# EAGLE design Sensor_Board_0x06_CO2_CCS811_v2 (EAGLE 8.5.2)
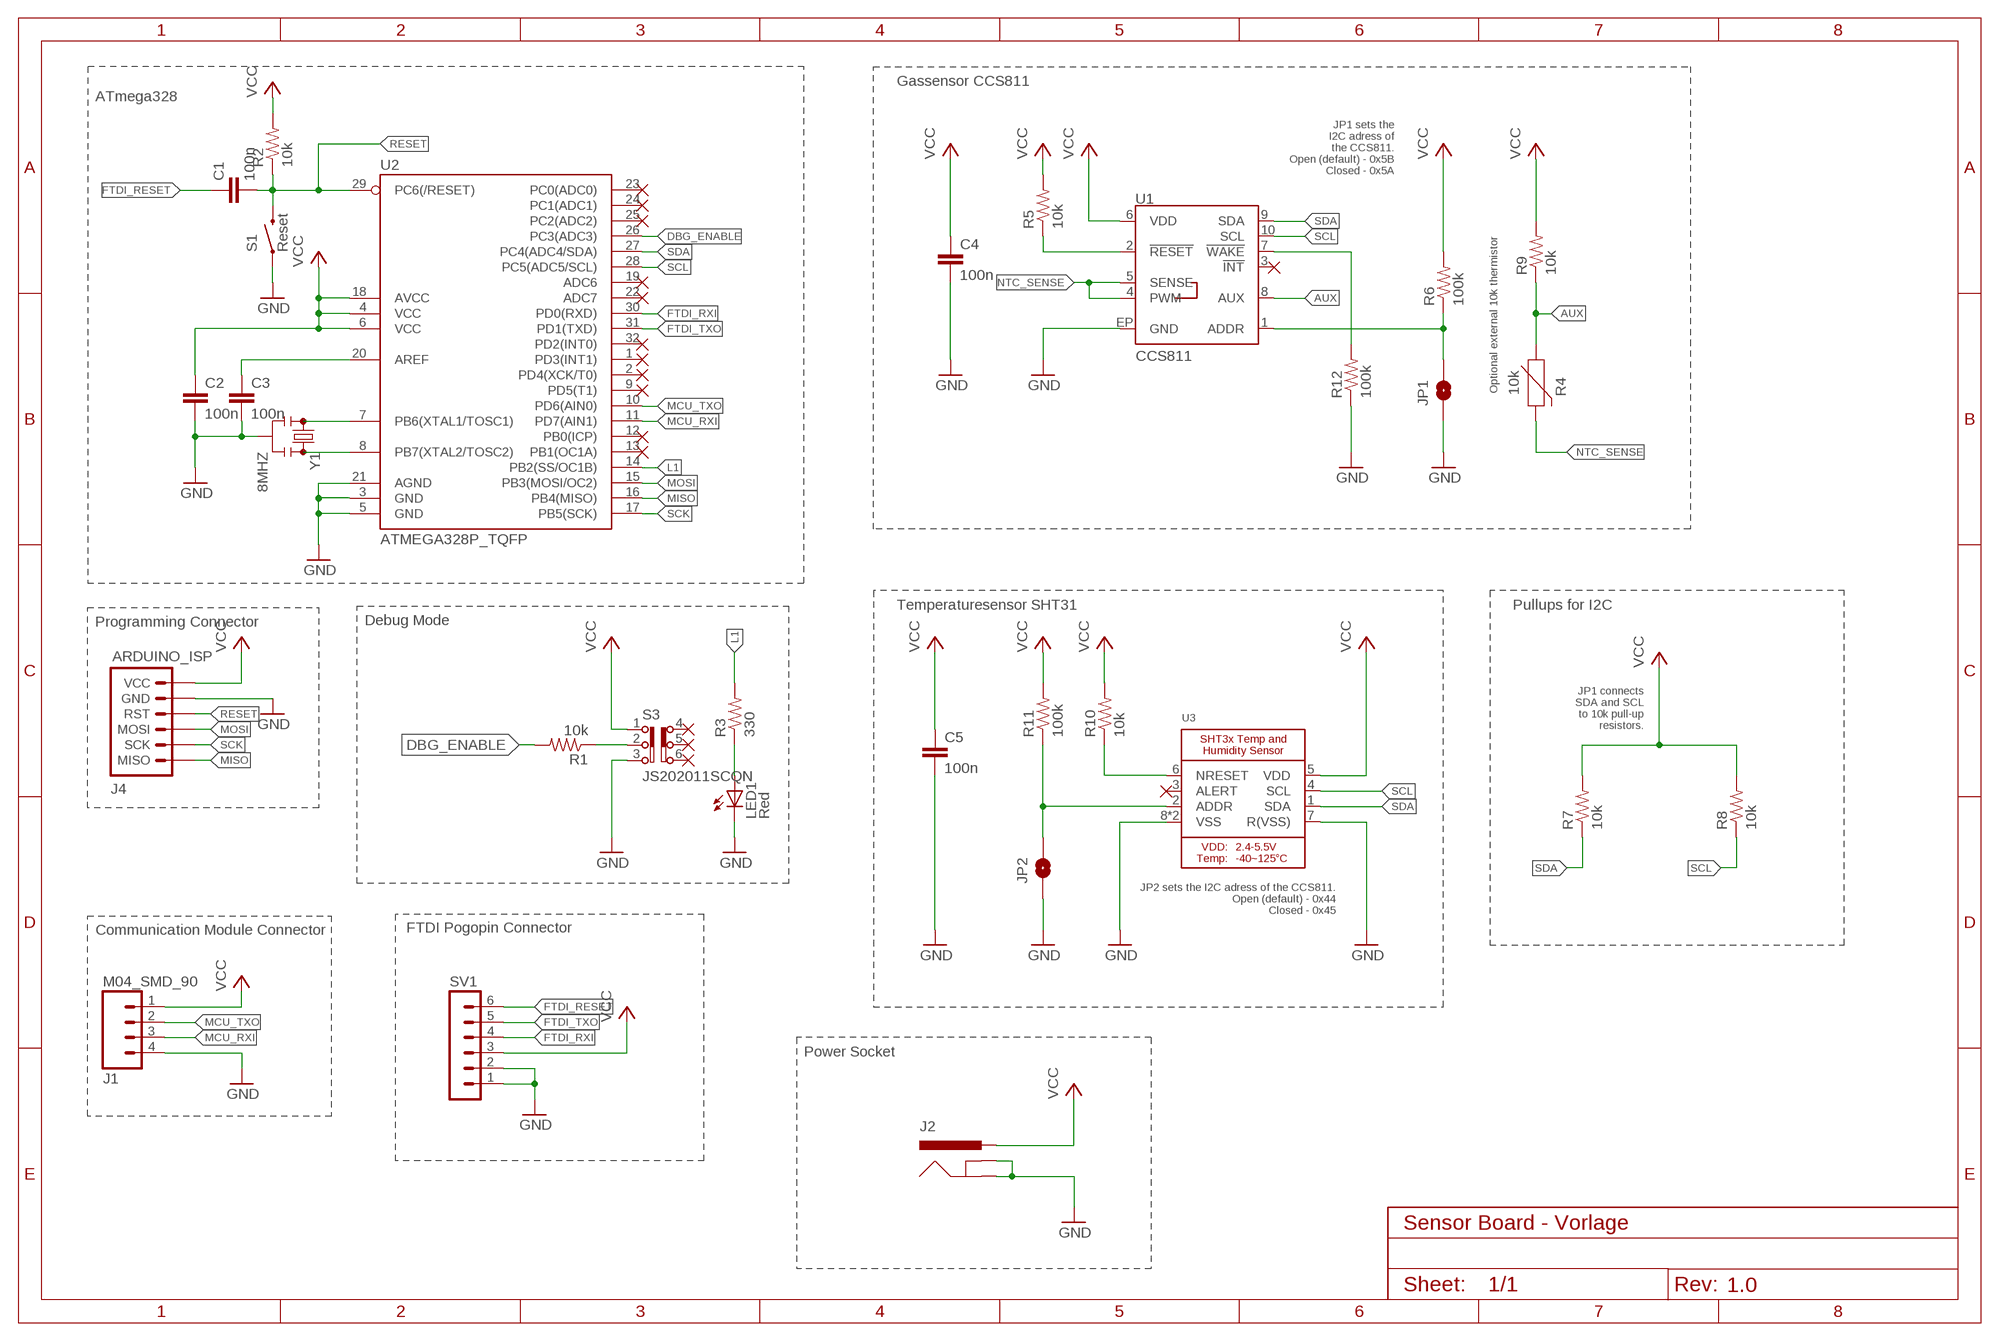
[diagram p0: schematic, sheet 1]
FRAME1 (FRAME-A4L): CNAME: Communication Module; CREVISION: 2.0

## Parts
C1  100n  C  [C0805]
C2  100n  C  [C0805]
C3  100n  C  [C0805]
C4  100n  C  [C0805]
C5  100n  C  [C0805]
J1  M04_SMD_90  [M04_SMD_90]
J2  5.5x2.1mm Barrel  POWER_JACKSMD  [POWER_JACK_SMD]
J4  ARDUINO_ISP  [M-2X3]
JP1  SPARKFUN-JUMPERS_JUMPER-SMT_2_NO_SILK  [SPARKFUN-JUMPERS_SMT-JUMPER_2_NO_SILK]
JP2  SPARKFUN-JUMPERS_JUMPER-SMT_2_NO_SILK  [SPARKFUN-JUMPERS_SMT-JUMPER_2_NO_SILK]
LED1  Red  LEDSML0805  [SML0805]
R1  10k  RESISTOR0805-RES  [0805]
R2  10k  RESISTOR0805-RES  [0805]
R3  330  RESISTOR0805-RES  [0805]
R4  10k  CCS811_BREAKOUT_TEMP_NTC-THERMISTOR-0603  [CCS811_BREAKOUT_TEMP_0603]
R5  10k  RESISTOR0805-RES  [0805]
R6  100k  RESISTOR0805-RES  [0805]
R7  10k  RESISTOR0805-RES  [0805]
R8  10k  RESISTOR0805-RES  [0805]
R9  10k  RESISTOR0805-RES  [0805]
R10  10k  RESISTOR0805-RES  [0805]
R11  100k  RESISTOR0805-RES  [0805]
R12  100k  RESISTOR0805-RES  [0805]
S1  Reset  PUSHBUTTON  [M-PUSHBUTTON-SMD]
S3  JS202011SCQN  [JS202011SCQN]
SV1  MA06-1  [MA06-1]
U1  CCS811  CCS811_BREAKOUT_TEMP_CCS811  [CCS811_BREAKOUT_TEMP_LGA10]
U2  ATMEGA328P_TQFP  [TQFP32-08]
U3  MICROBUILDER_SHT3X  [MICROBUILDER_SHT3X]
Y1  8MHZ  RESONATOR8MHZ  [RESONATOR-SMD]

## Nets
AUX: R4.1 R9.1 U1.8(AUX)
DBG_ENABLE: R1.2 U2.26(PC3(ADC3))
FTDI_RESET: C1.1 SV1.6
FTDI_RXI: SV1.4 U2.30(PD0(RXD))
FTDI_TXO: SV1.5 U2.31(PD1(TXD))
GND [GND]: C2.2 C3.2 C4.2 C5.2 J1.4 J2.GND(GNDBREAK) J2.P$4(GND) J4.P$5(GND) JP1.1 JP2.1 LED1.C R12.1 S1.1(LEFT) S1.2(LEFT) S3.3 SV1.1 SV1.2 U1.EP(GND) U2.3(GND) U2.5(GND) U2.21(AGND) U3.7(R(VSS)) U3.8(VSS) U3.THERMAL(VSS) Y1.2
L1: R3.2 U2.14(PB2(SS/OC1B))
MCU_RXI: J1.3 U2.11(PD7(AIN1))
MCU_TXO: J1.2 U2.10(PD6(AIN0))
MISO: J4.P$1(MISO) U2.16(PB4(MISO))
MOSI: J4.P$3(MOSI) U2.15(PB3(MOSI/OC2))
N$1: U2.8(PB7(XTAL2/TOSC2)) Y1.3
N$2: U2.7(PB6(XTAL1/TOSC1)) Y1.1
N$3: R1.1 S3.2
N$4: JP1.2 R6.1 U1.1(ADDR)
N$5: R12.2 U1.7(!WAKE!)
N$7: R10.1 U3.6(NRESET)
N$8: JP2.2 R11.1 U3.2(ADDR)
N$15: C3.1 U2.20(AREF)
N$30: LED1.A R3.1
NTC_SENSE: R4.2 U1.4(PWM) U1.5(SENSE)
RESET: C1.2 J4.P$4(RST) R2.1 S1.3(RIGHT) S1.4(RIGHT) U2.29(PC6(/RESET))
SCK: J4.P$2(SCK) U2.17(PB5(SCK))
SCL: R8.1 U1.10(SCL) U2.28(PC5(ADC5/SCL)) U3.4(SCL)
SDA: R7.1 U1.9(SDA) U2.27(PC4(ADC4/SDA)) U3.1(SDA)
SENS_RES: R5.1 U1.2(!RESET!)
VCC [Vsupply]: C2.1 C4.1 C5.1 J1.1 J2.VIN0(PWR) J2.VIN1(PWR) J4.P$6(VCC) R2.2 R5.2 R6.2 R7.2 R8.2 R9.2 R10.2 R11.2 S3.1 SV1.3 U1.6(VDD) U2.4(VCC) U2.6(VCC) U2.18(AVCC) U3.5(VDD)
Unconnected: S3.4 S3.5 S3.6 U1.3(!INT!) U2.1(PD3(INT1)) U2.2(PD4(XCK/T0)) U2.9(PD5(T1)) U2.12(PB0(ICP)) U2.13(PB1(OC1A)) U2.19(ADC6) U2.22(ADC7) U2.23(PC0(ADC0)) U2.24(PC1(ADC1)) U2.25(PC2(ADC2)) U2.32(PD2(INT0)) U3.3(ALERT)

## Notes on the sheet
- Gassensor CCS811
- ATmega328
- JP1 sets the 
  I2C adress of 
  the CCS811. 
  Open (default) - 0x5B 
  Closed - 0x5A
- Optional external 10k thermistor
- Temperaturesensor SHT31 | Pullups for I2C
- Programming Connector | Debug Mode
- JP1 connects
  SDA and SCL
  to 10k pull-up
  resistors.
- JP2 sets the I2C adress of the CCS811.
  Open (default) - 0x44
  Closed - 0x45
- Communication Module Connector | FTDI Pogopin Connector
- Power Socket
- Sensor Board - Vorlage
- 1.0

## Library data of the parts
C1-C5 = eagle-ltspice:C: CAPACITOR, European symbol; SPICEMODEL: NONE; SPICEPREFIX: C
J1 = myownthings:M04_SMD_90
J2 = wsn:POWER_JACK: Power Jack This is the standard 5.5mm barrel jack for power. The PTH is the most common, proven, reliable, footprint. The Slot footprint only works if the mill layer is transmitted to the PCB fab house so be warned. Mating wall wart : TOL-00298 (and others); PROD_ID: CONN-08106; SF_ID: PRT-12748
J4 = marc_library:ARDUINO_ISP: AVR ISP 6-pin inline header for Arduino ISP
JP1 JP2 = SparkFun_CSS811_Breakout:SPARKFUN-JUMPERS_JUMPER-SMT_2_NO: Normally open jumper This jumper has two pads in close proximity to each other. Apply solder to close the connection. Round pads are easier to solder for beginners, but are a lot larger. SparkFun Product that uses the round pads: SparkFun EL Sequencer <https://www.sparkfun.com/products/12781>
LED1 = led:LED: LED OSRAM: - CHIPLED LG R971, LG N971, LY N971, LG Q971, LY Q971, LO R971, LY R971 LH N974, LH R974 LS Q976, LO Q976, LY Q976 LO Q996 - Hyper CHIPLED LW Q18S LB Q993, LB Q99A, LB R99A - SideLED LS A670, LO A670, LY A670, LG A670, LP A670 LB A673, LV A673, LT A673, LW A673 LH A674 LY A675 LS A676, LA A676, LO A676, LY A676, LW A676 LS A679, LY A679, LG A679 - Hyper Micro SIDELED® LS Y876, LA Y876, LO Y876, LY Y876 LT Y87S - SmartLED LW L88C, LW L88S LB L89C, LB L89S, LG L890 LS L89K, LO L89K, LY L89K LS L896, LA L896, LO L896, LY L896 - TOPLED LS T670, LO T670, LY T670, LG T670, LP T670 LSG T670, LSP T670, LSY T670, LOP T670, LYG T670 LG T671, LOG T671, LSG T671 LB T673, LV T673, LT T673, LW T673 LH T674 LS T676, LA T676, LO T676, LY T676, LB T676, LH T676, LSB T676, LW T676 LB T67C, LV T67C, LT T67C, LS T67K, LO T67K, LY T67K, LW E67C LS E67B, LA E67B, LO E67B, LY E67B, LB E67C, LV E67C, LT E67C LW T67C LS T679, LY T679, LG T679 LS T770, LO T770, LY T770, LG T770, LP T770 LB T773, LV T773, LT T773, LW T773 LH T774 LS E675, LA E675, LY E675, LS T675 LS T776, LA T776, LO T776, LY T776, LB T776 LHGB T686 LT T68C, LB T68C - Hyper Mini TOPLED® LB M676 - Mini TOPLED Santana® LG M470 LS M47K, LO M47K, LY M47K Source: http://www.osram.convergy.de LUXEON: - LUMILED® LXK2-PW12-R00, LXK2-PW12-S00, LXK2-PW14-U00, LXK2-PW14-V00 LXK2-PM12-R00, LXK2-PM12-S00, LXK2-PM14-U00 LXK2-PE12-Q00, LXK2-PE12-R00, LXK2-PE12-S00, LXK2-PE14-T00, LXK2-PE14-U00 LXK2-PB12-K00, LXK2-PB12-L00, LXK2-PB12-M00, LXK2-PB14-N00, LXK2-PB14-P00, LXK2-PB14-Q00 LXK2-PR12-L00, LXK2-PR12-M00, LXK2-PR14-Q00, LXK2-PR14-R00 LXK2-PD12-Q00, LXK2-PD12-R00, LXK2-PD12-S00 LXK2-PH12-R00, LXK2-PH12-S00 LXK2-PL12-P00, LXK2-PL12-Q00, LXK2-PL12-R00 Source: www.luxeon.com KINGBRIGHT: KA-3528ASYC Source: www.kingbright.com
R1-R3 R5-R12 = SparkFun-Passives:RESISTOR: Resistor Basic schematic elements and footprints for 0603, 1206, and PTH resistors.
R4 = SparkFun_CSS811_Breakout:CCS811_BREAKOUT_TEMP_NTC-THERMISTOR: NTC Thermistor An NTC thermistor's resistance decreases as temperature rises. Applications: Resistance Thermometer - temperature monitoring Inrush current limiter Heat source; PROD_ID: RES-13608
S1 = marc_library:PUSHBUTTON
S3 = myownthings:JS202011SCQN: DPDT SLIDE SWITCH
SV1 = con-lstb:MA06-1: PIN HEADER; OC_FARNELL: unknown; OC_NEWARK: unknown
U1 = SparkFun_CSS811_Breakout:CCS811_BREAKOUT_TEMP_CCS811: AMS CCS811 – I2C Digital Gas Sensor Ultra-Low Power Digital Gas Sensor for Monitoring Indoor Air Quality AMS Product Page <http://ams.com/eng/Products/Environmental-Sensors/Gas-Sensors/CCS811> SparkFun Products:; PROD_ID: IC-13607
U2 = marc_library:ATMEGA328P_TQFP; PROD_ID: IC-09069
U3 = Adafruit SHT31 Breakout:MICROBUILDER_SHT3X: SHT3x - Digital Temperature and Humidity Sensor Supply Voltage: 2.4-5.5V Humidity Accuracy: SHT30 = +/-3%RH, SHT31 = +/-2%RH Temperature Sensor: -40~125°C (+/-0.3°C from 10-55C)
Y1 = marc_library:RESONATOR: Resonator Small SMD resonator. Used, eg, on the Arduino Pro/ Pro Mini boards. 8MHz- XTAL-08895 16MHz- XTAL-08900; PROD_ID: XTAL-08895

## Net classes
0 default: width 0.3 mm
1 Vsupply: width 0.5 mm
5 GND: width 0.5 mm

## Board
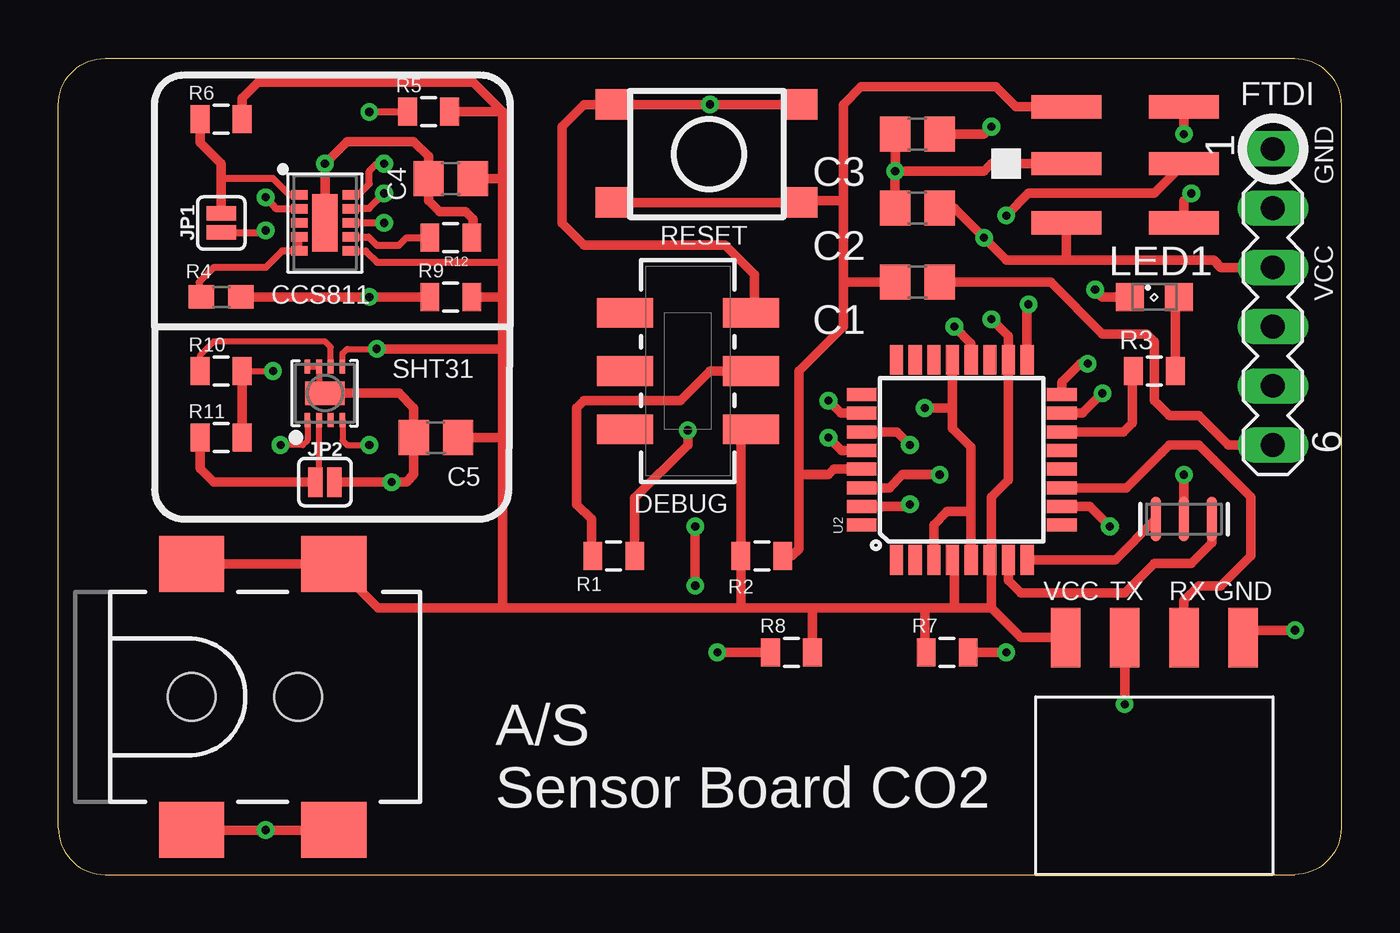
[diagram p1: board, top side]
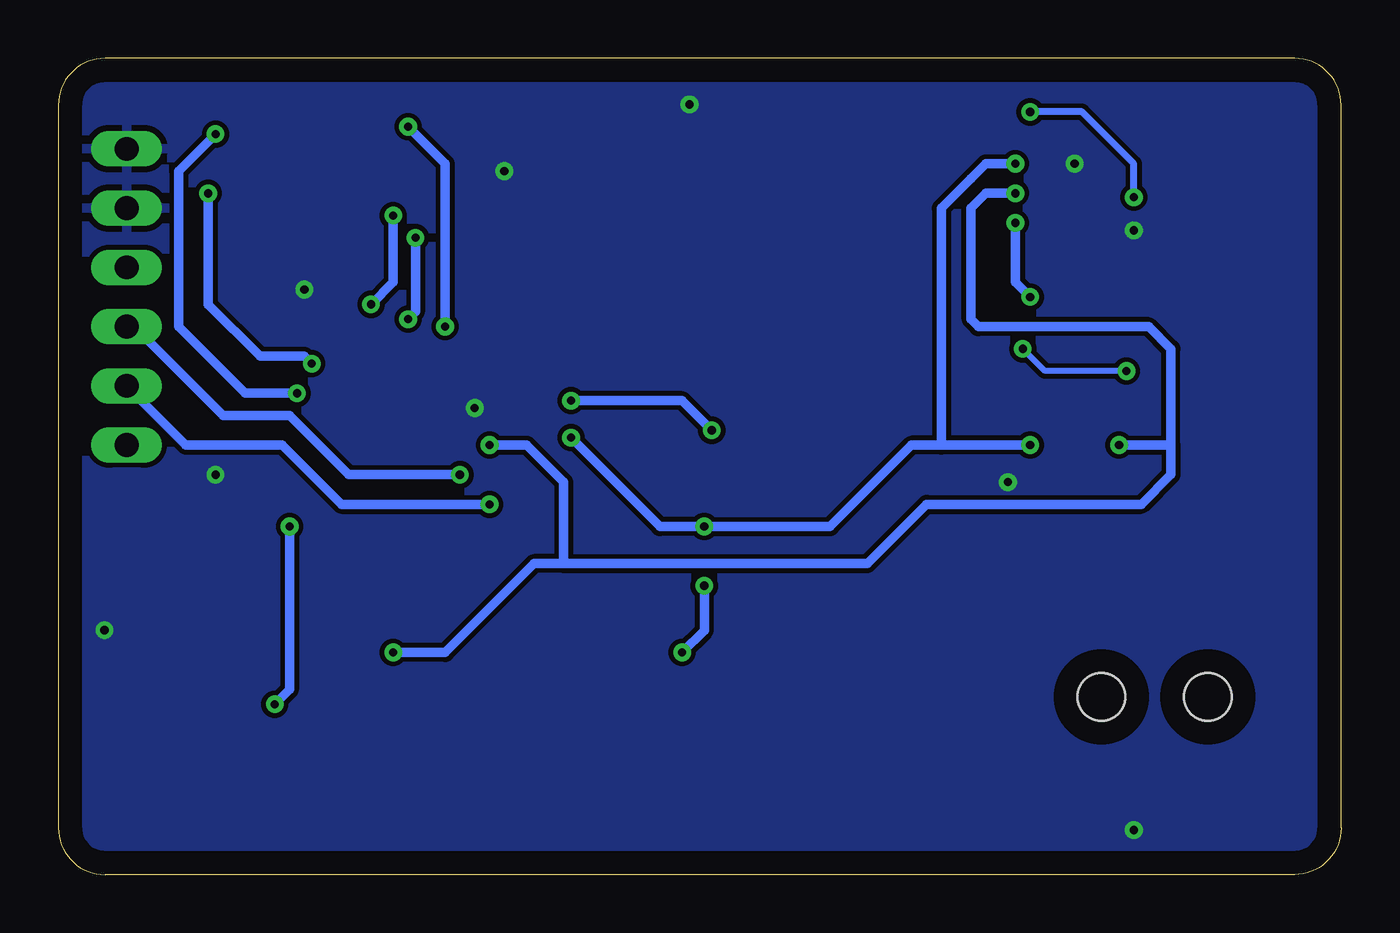
[diagram p2: board, bottom side, seen from below]

Size 55 x 35 mm. Coordinates in mm from the lower left corner, seen from the top.
Outline: 55,33 55,2 arc-90 53,0 2,0 arc-90 0,2 0,33 arc-90 2,35 53,35 arc-90 55,33
Copper layers (1*16): Top 0.035mm / dielectric 1.5mm / Bottom 0.035mm
Design rules "default *": minimum track width 14mil, minimum drill 24mil, track to track 8mil, track to pad 8mil, pad to pad 8mil, via to via 8mil, smd to smd 8mil, copper to edge 40mil, drill to drill 8mil, minimum pad ring 10mil, minimum via ring 8mil, stop-mask expansion 4mil, vias tented up to drill 0mil, thermal gap 10mil

### Footprints (pad centres in the part's own frame; a part is rotated, then mirrored left to right if it is on the bottom)
C0805 = smd 1.3 x 1.5: 1 -0.95,0; 2 0.95,0
M04_SMD_90 = smd 1.27 x 2.54: 1 0,0; 2 2.54,0; 3 5.08,0; 4 7.62,0
POWER_JACK_SMD = smd 2.8 x 2.4: GND 0,-5.7; P$4 6.1,-5.7; VIN0 0,5.7; VIN1 6.1,5.7 | hole 2.032: 0,0; 4.572,0
M-2X3 = smd 1 x 3: P$1 0,0; P$2 2.54,0; P$3 4.98,0; P$4 4.98,5.05; P$5 2.54,5.05; P$6 0,5.05
SPARKFUN-JUMPERS_SMT-JUMPER_2_NO_SILK = smd 0.635 x 1.27: 1 -0.406,0; 2 0.406,0
SML0805 = smd 1.2 x 1.2: A 1.05,0; C -1.05,0
0805 = smd 0.8 x 1.2: 1 -0.9,0; 2 0.9,0
CCS811_BREAKOUT_TEMP_0603 = smd 1.1 x 1: 1 -0.85,0; 2 0.85,0
M-PUSHBUTTON-SMD = smd 1.55 x 1.3: 1 0,0; 2 7.95,0; 3 0,-4.2; 4 7.95,-4.2
JS202011SCQN = smd 1.27 x 2.4: 1 -2.5,-2.7; 2 0,-2.7; 3 2.5,-2.7; 4 -2.5,2.7; 5 0,2.7; 6 2.5,2.7
MA06-1 = drill 1.016 long: 1 -6.35,0; 2 -3.81,0; 3 -1.27,0; 4 1.27,0; 5 3.81,0; 6 6.35,0
CCS811_BREAKOUT_TEMP_LGA10 = smd 0.7 x 0.4: 1 -1.1,1.2; 2 -1.1,0.6; 3 -1.1,0; 4 -1.1,-0.6; 5 -1.1,-1.2; 6 1.1,-1.2; 7 1.1,-0.6; 8 1.1,0; 9 1.1,0.6; 10 1.1,1.2 | smd 1.1 x 2.45: EP 0,0
TQFP32-08 = smd 1.27 x 0.559: 1 -4.293,2.8; 2 -4.293,2; 3 -4.293,1.2; 4 -4.293,0.4; 5 -4.293,-0.4; 6 -4.293,-1.2; 7 -4.293,-2; 8 -4.293,-2.8; 17 4.293,-2.8; 18 4.293,-2; 19 4.293,-1.2; 20 4.293,-0.4; 21 4.293,0.4; 22 4.293,1.2; 23 4.293,2; 24 4.293,2.8 | smd 0.559 x 1.27: 9 -2.8,-4.293; 10 -2,-4.293; 11 -1.2,-4.293; 12 -0.4,-4.293; 13 0.4,-4.293; 14 1.2,-4.293; 15 2,-4.293; 16 2.8,-4.293; 25 2.8,4.293; 26 2,4.293; 27 1.2,4.293; 28 0.4,4.293; 29 -0.4,4.293; 30 -1.2,4.293; 31 -2,4.293; 32 -2.8,4.293
MICROBUILDER_SHT3X = smd 0.6 x 0.25: 1 -1.15,0.75; 2 -1.15,0.25; 3 -1.15,-0.25; 4 -1.15,-0.75; 5 1.15,-0.75; 6 1.15,-0.25; 7 1.15,0.25; 8 1.15,0.75 | smd 1 x 1.7: THERMAL 0,0
RESONATOR-SMD = smd 0.45 x 1.905: 1 -1.2,0; 2 0,0; 3 1.2,0

### Placement (x,y rotation side)
C1  36.83,25.4 180 top
C2  36.83,28.57 180 top
C3  36.83,31.75 180 top
C4  16.83,29.84 180 top
C5  16.19,18.73 180 top
J1  43.18,10.16 0 top
J2  5.71,7.62 0 top
J4  48.26,27.94 90 top
JP1  6.99,27.94 90 top
JP2  11.43,16.83 180 top
LED1  46.99,24.77 0 top
R1  23.81,13.65 0 top
R2  30.16,13.65 180 top
R3  46.99,21.59 180 top
R4  6.99,24.77 180 top
R5  15.88,32.7 0 top
R6  6.99,32.38 0 top
R7  38.1,9.53 180 top
R8  31.43,9.53 0 top
R9  16.83,24.77 0 top
R10  6.99,21.59 0 top
R11  6.99,18.73 0 top
R12  16.83,27.3 180 top
S1  23.81,33.02 0 top
S3  26.99,21.59 90 top
SV1  52.07,24.77 270 top
U1  11.43,27.94 0 top
U2  38.73,17.78 90 top
U3  11.43,20.64 90 top
Y1  48.26,15.24 180 top

### Tracks (layer width: path | path; a pad name or v marks a point on that pad's centre or on a via)
AUX  (via drill 0.35)
  Top 0.305: v13.97,27.94 U1.8
  Top 0.406: R4.1 v13.34,24.77 R9.1
  Bottom 0.406: v13.97,27.94 13.97,25.4 v13.34,24.77
DBG_ENABLE  (via drill 0.35)
  Top 0.406: U2.26 33.56,19.78 v33.02,20.32 | v26.99,19.05 26.99,18.41 24.71,16.14 R1.2
  Bottom 0.406: v26.99,19.05 28.26,20.32 v33.02,20.32
FTDI_RESET
  Top 0.406: C1.1 42.55,25.4 44.77,23.18 46.67,23.18 46.99,22.86 46.99,20.32 47.62,19.68 48.9,19.68 50.16,18.41 SV1.6
FTDI_RXI  (via drill 0.35)
  Top 0.406: U2.30 35.63,16.58 36.2,17.14 v37.78,17.14
  Bottom 0.406: SV1.4 51.75,23.5 47.94,19.68 45.09,19.68 42.55,17.14 v37.78,17.14
FTDI_TXO  (via drill 0.35)
  Top 0.406: U2.31 36.42,15.78 v36.51,15.88
  Bottom 0.406: SV1.5 49.53,18.41 45.4,18.41 42.86,15.88 v36.51,15.88
GND  (via drill 0.35)
  Top 0.254: U3.THERMAL 11.18,20.89 U3.7 U3.8
  Top 0.305: JP1.1 8.8,27.53 v8.89,27.62
  Top 0.406: S1.2 v27.94,33.02 S1.1 22.54,33.02 21.59,32.07 21.59,27.94 22.54,26.99 28.57,26.99 29.84,25.72 29.84,24.25 S3.3 | 38.34,20 38.34,19.13 39.13,18.33 39.13,15.56 | 38.34,20 U2.21 | 39.13,15.56 U2.5 | U2.3 37.53,14.99 38.1,15.56 39.13,15.56 | v53.02,10.48 51.12,10.48 J1.4 | v48.26,17.14 Y1.2 | v37.15,20 38.34,20 | v44.45,25.08 44.77,24.77 LED1.C | J4.P$5 40.01,30.48 39.69,30.16 v35.88,30.16 | C3.2 v35.88,30.16 | v35.88,30.16 C2.2 | JP2.1 v14.29,16.83 14.92,16.83 15.24,17.15 C5.2 15.24,20 14.61,20.64 U3.THERMAL | U1.EP v11.43,30.48 12.38,31.43 15.24,31.43 15.88,30.8 C4.2 15.88,28.89 16.35,28.42 17.46,28.42 17.78,28.1 17.78,27.36 R12.1 | J2.GND 5.73,1.91 v8.89,1.91 11.8,1.91 J2.P$4
  pour Bottom: 55,33 55,2 arc-90 53,0 2,0 arc-90 0,2 0,33 arc-90 2,35 53,35 arc-90
L1
  Top 0.406: U2.14 45.65,18.98 46.04,19.37 46.04,21.54 R3.2
MCU_RXI
  Top 0.406: U2.11 45.79,16.58 47.31,18.1 47.62,18.41 48.9,18.41 49.53,17.78 51.12,16.19 51.12,13.65 49.85,12.38 48.9,12.38 48.26,11.75 J1.3
MCU_TXO  (via drill 0.35)
  Top 0.406: U2.10 44.23,15.78 v45.09,14.92 | v45.72,7.3 J1.2
  Bottom 0.406: v45.09,14.92 45.09,7.94 v45.72,7.3
MISO  (via drill 0.35)
  Top 0.406: J4.P$1 48.26,28.89 v48.58,29.21 | U2.16 43.03,21.12 43.81,21.91 v44.13,21.91
  Bottom 0.406: v48.58,29.21 48.58,24.45 46.35,22.23 44.45,22.23 v44.13,21.91
MOSI  (via drill 0.35)
  Top 0.406: J4.P$3 v48.26,31.75 | v44.77,20.64 43.91,19.78 U2.15
  Bottom 0.406: v48.26,31.75 49.85,30.16 49.85,23.5 46.99,20.64 v44.77,20.64
N$1
  Top 0.406: Y1.3 45.31,13.49 U2.8
N$2
  Top 0.406: Y1.1 49.46,14.22 48.58,13.34 46.99,13.34 45.72,12.06 41.27,12.06 40.73,12.61 U2.7
N$3
  Top 0.406: S3.2 27.94,21.59 26.67,20.32 22.54,20.32 22.23,20 22.23,15.88 22.86,15.24 22.86,13.71 R1.1
N$4
  Top 0.305: U1.1 9.91,29.14 9.21,29.84 6.99,29.84
  Top 0.406: R6.1 6.08,31.38 6.99,30.48 6.99,29.84 JP1.2
N$5
  Top 0.305: U1.7 13.3,27.34 13.65,26.99 14.61,26.99 14.92,27.3 R12.2
N$7
  Top 0.254: R10.1 6.08,22.28 6.67,22.86 11.43,22.86 11.68,22.61 U3.6
N$8
  Top 0.254: JP2.2 11.18,16.98 U3.2
  Top 0.406: R11.1 6.08,17.41 6.67,16.83 JP2.2
N$15  (via drill 0.35)
  Top 0.406: C3.1 39.69,31.75 v40.01,32.07 | v38.42,23.5 39.13,22.78 U2.20
  Bottom 0.406: v38.42,23.5 38.42,30.48 v40.01,32.07
N$30
  Top 0.406: R3.1 47.89,24.61 LED1.A
NTC_SENSE
  Top 0.305: U1.4 U1.5 9.6,26.74 8.89,26.04 6.67,26.04 6.03,25.4 6.03,25.01 arc45 R4.2
RESET
  Top 0.406: J4.P$4 41.06,32.92 40.2,33.78 34.42,33.78 33.66,33.02 33.66,28.89 | 33.66,28.89 33.66,25.4 | 33.66,25.4 33.66,23.5 31.75,21.59 31.75,17.14 | R2.1 31.43,13.65 31.75,13.97 31.75,17.14 | C1.2 33.66,25.4 | S1.3 S1.4 31.84,28.89 33.66,28.89 | U2.29 33.26,17.38 33.02,17.14 31.75,17.14
SCK  (via drill 0.35)
  Top 0.406: J4.P$2 46.99,29.21 41.59,29.21 v40.64,28.26 | U2.17 41.53,24.39 v41.59,24.45
  Bottom 0.406: v40.64,28.26 40.64,25.4 v41.59,24.45
SCL  (via drill 0.35)
  Top 0.254: U3.4 12.18,18.62 12.38,18.41 v13.34,18.41
  Top 0.305: U1.10 12.86,29.14 13.34,29.61 13.34,30.16 13.65,30.48 v13.97,30.48
  Top 0.406: U2.28 33.57,18.18 v33.02,18.73 | R8.1 v28.26,9.53 | v27.3,12.38 v27.3,14.92
  Bottom 0.406: v33.02,18.73 29.21,14.92 v27.3,14.92 21.91,14.92 18.41,18.41 17.14,18.41 | v13.97,30.48 15.24,30.48 15.88,29.84 17.14,28.57 17.14,18.41 | v28.26,9.53 27.3,10.48 v27.3,12.38 | v13.34,18.41 17.14,18.41
SDA  (via drill 0.35)
  Top 0.254: U3.1 10.68,18.62 10.48,18.41 v9.53,18.41
  Top 0.305: U1.9 12.56,28.57 13.34,28.57 v13.97,29.21
  Top 0.406: U2.27 35.95,18.98 v36.51,18.41 | R7.1 v40.64,9.53
  Bottom 0.406: 7.3,18.41 7.3,22.54 8.26,23.5 15.56,23.5 15.88,23.81 15.88,28.57 15.24,29.21 v13.97,29.21 | 7.3,18.41 7.3,17.14 8.57,15.88 17.78,15.88 20.32,13.34 33.34,13.34 | v9.53,18.41 7.3,18.41 | v40.64,9.53 38.42,9.53 34.61,13.34 33.34,13.34 | v36.51,18.41 34.92,18.41 33.34,16.83 33.34,13.34
SENS_RES  (via drill 0.35)
  Top 0.305: U1.2 9.34,28.54 v8.89,29.04 | v13.34,32.7 R5.1
  Bottom 0.305: v8.89,29.04 8.89,30.48 11.11,32.7 v13.34,32.7
VCC  (via drill 0.35)
  Top 0.254: R10.2 v9.21,21.59 | U3.5 12.18,22.34 12.38,22.54 v13.65,22.54
  Top 0.305: U1.6 13.18,26.74 13.67,26.25 18.95,26.25 19.05,26.35
  Top 0.406: C2.1 38.42,28.57 v39.69,27.3 40.64,26.35 43.18,26.35 | 43.18,26.35 49.53,26.35 49.85,26.04 SV1.3 | J4.P$6 43.21,26.38 43.18,26.35 | S3.1 29.26,18.66 R2.2 29.26,11.48 29.21,11.43 | J1.1 41.27,10.16 40.01,11.43 | 38.42,11.43 40.01,11.43 | 40.01,11.43 40.01,13.42 U2.6 40.01,13.56 40.01,16.19 40.73,16.92 U2.18 40.73,23.08 v40.01,23.81 | U2.4 38.42,13.4 38.42,11.43 | R11.2 R10.2 | 32.38,11.43 37.15,11.43 | 37.15,11.43 38.42,11.43 | R7.2 37.15,9.58 37.15,11.43 | R8.2 32.33,11.38 32.38,11.43 | 32.38,11.43 29.21,11.43 | R6.2 7.88,33.28 8.57,33.97 17.78,33.97 19.05,32.7 | 29.21,11.43 19.05,11.43 | 19.05,11.43 13.71,11.43 J2.VIN1 J2.VIN0 | 19.05,32.7 19.05,29.84 | 19.05,29.84 19.05,26.35 19.05,24.77 | 19.05,24.77 19.05,22.54 | 19.05,22.54 19.05,18.73 | 19.05,18.73 19.05,11.43 | C5.1 19.05,18.73 | v13.65,22.54 19.05,22.54 | R9.2 19.05,24.77 | R5.2 19.05,32.7 | C4.1 19.05,29.84
  Bottom 0.254: v9.21,21.59 12.7,21.59 v13.65,22.54
  Bottom 0.406: v39.69,27.3 39.69,24.13 v40.01,23.81

### Text on the board
tPlace: FTDI | GND | RESET | VCC | CCS811 | SHT31 | DEBUG | VCC | TX | RX | GND | A/S / Sensor Board CO2